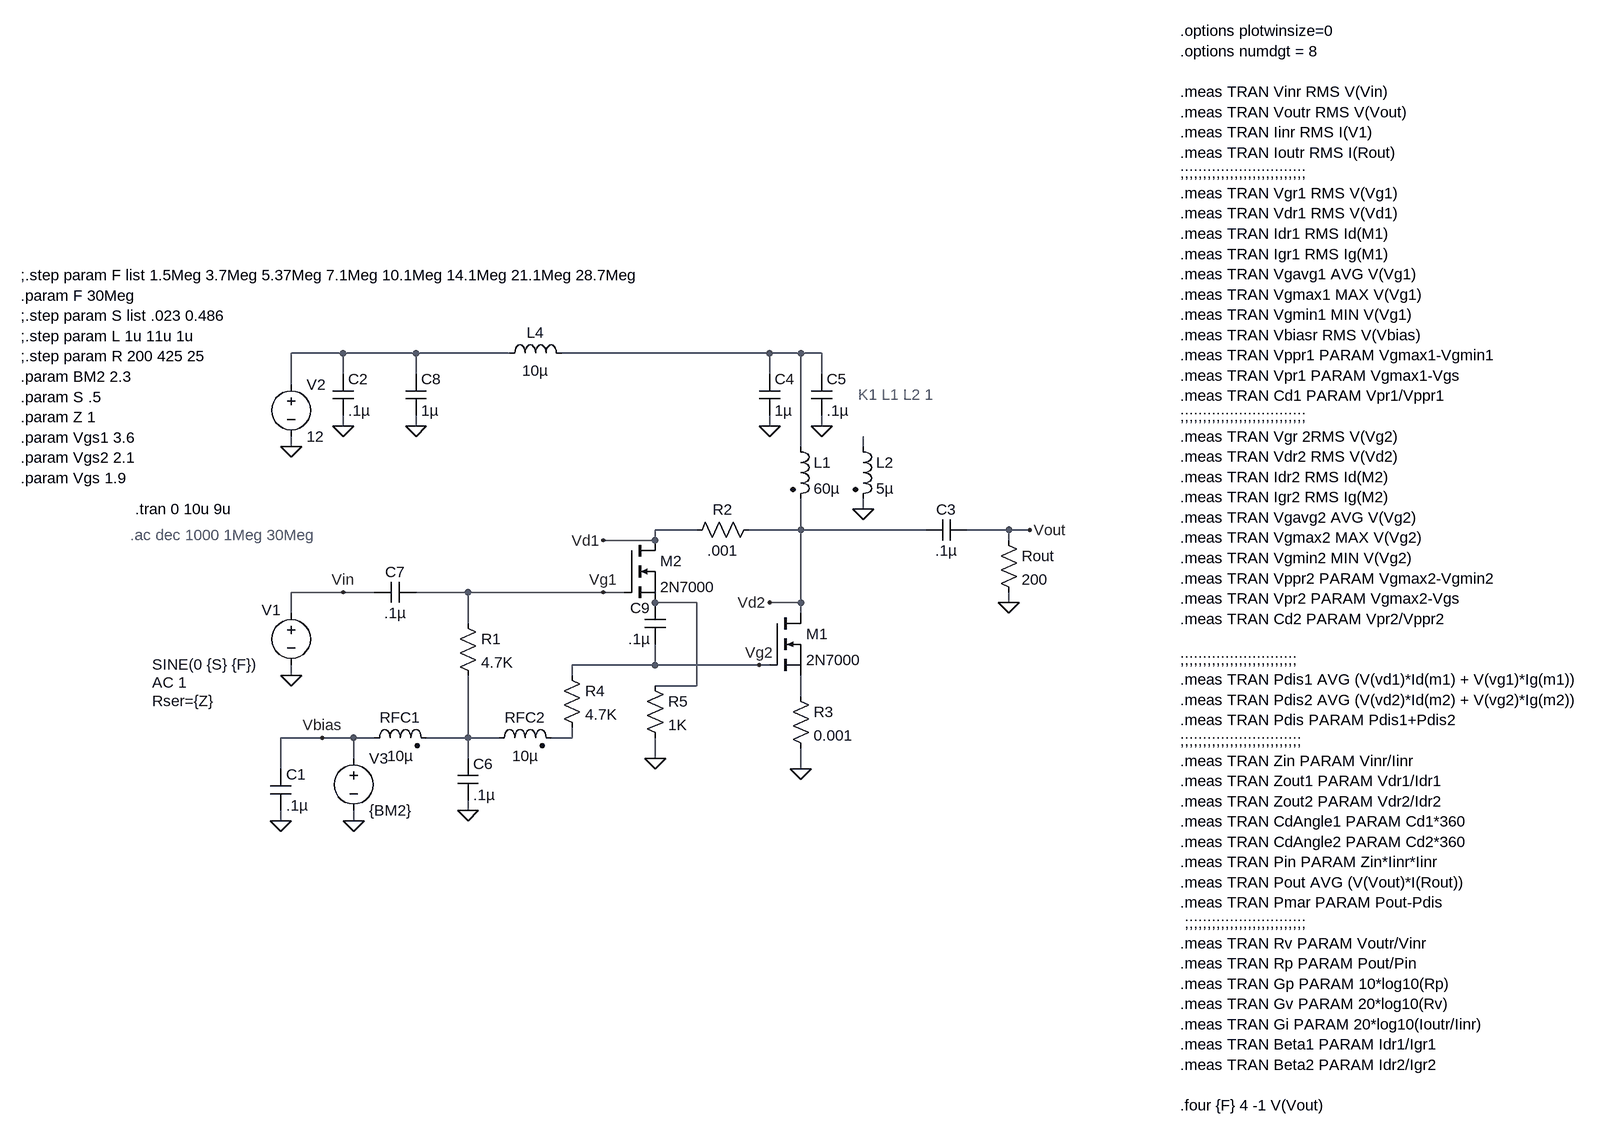
[diagram p0: schematic 2N7000 Darlington testing.asc]
2N7000 Darlington testing.asc, the LTspice schematic file:
Version 4
SHEET 1 3360 1496
WIRE -64 -176 -144 -176
WIRE 48 -176 -64 -176
WIRE 192 -176 48 -176
WIRE 592 -176 272 -176
WIRE 640 -176 592 -176
WIRE 672 -176 640 -176
WIRE -64 -144 -64 -176
WIRE 48 -144 48 -176
WIRE 592 -144 592 -176
WIRE 672 -144 672 -176
WIRE -144 -128 -144 -176
WIRE -64 -64 -64 -80
WIRE 48 -64 48 -80
WIRE 592 -64 592 -80
WIRE 672 -64 672 -80
WIRE -144 -32 -144 -48
WIRE 640 -32 640 -176
WIRE 736 -32 736 -48
WIRE 736 64 736 48
WIRE 480 96 416 96
WIRE 640 96 640 48
WIRE 640 96 560 96
WIRE 832 96 640 96
WIRE 960 96 896 96
WIRE 992 96 960 96
WIRE 416 112 416 96
WIRE 416 112 336 112
WIRE 960 112 960 96
WIRE -64 192 -144 192
WIRE -16 192 -64 192
WIRE 128 192 48 192
WIRE 336 192 128 192
WIRE 368 192 336 192
WIRE 480 208 416 208
WIRE 640 208 640 96
WIRE 640 208 592 208
WIRE 960 208 960 192
WIRE -144 224 -144 192
WIRE 640 224 640 208
WIRE 128 240 128 192
WIRE 416 304 416 272
WIRE 416 304 288 304
WIRE 576 304 416 304
WIRE 592 304 576 304
WIRE -144 320 -144 304
WIRE 288 320 288 304
WIRE 480 336 480 208
WIRE 480 336 416 336
WIRE 640 352 640 320
WIRE -96 416 -160 416
WIRE -48 416 -96 416
WIRE -16 416 -48 416
WIRE 128 416 128 320
WIRE 128 416 64 416
WIRE 176 416 128 416
WIRE 288 416 288 400
WIRE 288 416 256 416
WIRE -48 448 -48 416
WIRE 128 448 128 416
WIRE 416 448 416 416
WIRE -160 464 -160 416
WIRE 640 464 640 432
WIRE 128 528 128 512
WIRE -160 544 -160 528
WIRE -48 544 -48 528
FLAG -64 -64 0
FLAG -144 -32 0
FLAG -144 320 0
FLAG 992 96 Vout
FLAG 960 208 0
FLAG 592 -64 0
FLAG 672 -64 0
FLAG -64 192 Vin
FLAG 736 64 0
FLAG 48 -64 0
FLAG 640 464 0
FLAG 576 304 Vg2
FLAG 592 208 Vd2
FLAG 336 192 Vg1
FLAG 336 112 Vd1
FLAG -160 544 0
FLAG 128 528 0
FLAG -48 544 0
FLAG -96 416 Vbias
FLAG 416 448 0
SYMBOL voltage -144 208 R0
WINDOW 0 -45 11 Left 2
WINDOW 3 -214 95 Left 2
WINDOW 123 -214 123 Left 2
WINDOW 39 -214 151 Left 2
SYMATTR InstName V1
SYMATTR Value SINE(0 {S} {F})
SYMATTR Value2 AC 1
SYMATTR SpiceLine Rser={Z}
SYMBOL voltage -144 -144 R0
WINDOW 123 0 0 Left 0
WINDOW 39 0 0 Left 0
SYMATTR InstName V2
SYMATTR Value 12
SYMBOL cap -80 -144 R0
SYMATTR InstName C2
SYMATTR Value .1µ
SYMBOL cap 896 80 R90
WINDOW 0 0 32 VBottom 2
WINDOW 3 32 32 VTop 2
SYMATTR InstName C3
SYMATTR Value .1µ
SYMBOL ind2 624 -48 R0
SYMATTR InstName L1
SYMATTR Value 60µ
SYMATTR Type ind
SYMBOL res 944 96 R0
SYMATTR InstName Rout
SYMATTR Value 200
SYMBOL cap 576 -144 R0
SYMATTR InstName C4
SYMATTR Value 1µ
SYMBOL cap 656 -144 R0
SYMATTR InstName C5
SYMATTR Value .1µ
SYMBOL cap 48 176 R90
WINDOW 0 0 32 VBottom 2
WINDOW 3 32 32 VTop 2
SYMATTR InstName C7
SYMATTR Value .1µ
SYMBOL ind2 720 -48 R0
SYMATTR InstName L2
SYMATTR Value 5µ
SYMATTR Type ind
SYMBOL ind 176 -160 R270
WINDOW 0 32 56 VTop 2
WINDOW 3 5 56 VBottom 2
SYMATTR InstName L4
SYMATTR Value 10µ
SYMBOL cap 32 -144 R0
SYMATTR InstName C8
SYMATTR Value 1µ
SYMBOL res 624 336 R0
SYMATTR InstName R3
SYMATTR Value 0.001
SYMBOL nmos 592 224 R0
SYMATTR InstName M1
SYMATTR Value 2N7000
SYMBOL nmos 368 112 R0
SYMATTR InstName M2
SYMATTR Value 2N7000
SYMBOL res 112 224 R0
SYMATTR InstName R1
SYMATTR Value 4.7K
SYMBOL ind2 -32 432 R270
WINDOW 0 32 56 VTop 2
WINDOW 3 4 56 VBottom 2
SYMATTR InstName RFC1
SYMATTR Value 10µ
SYMATTR Type ind
SYMBOL cap -176 464 R0
SYMATTR InstName C1
SYMATTR Value .1µ
SYMBOL cap 112 448 R0
SYMATTR InstName C6
SYMATTR Value .1µ
SYMBOL voltage -48 432 R0
WINDOW 123 0 0 Left 2
WINDOW 39 0 0 Left 2
SYMATTR InstName V3
SYMATTR Value {BM2}
SYMBOL res 576 80 R90
WINDOW 0 0 56 VBottom 2
WINDOW 3 32 56 VTop 2
SYMATTR InstName R2
SYMATTR Value .001
SYMBOL res 400 320 R0
SYMATTR InstName R5
SYMATTR Value 1K
SYMBOL cap 432 272 R180
WINDOW 0 24 56 Left 2
WINDOW 3 24 8 Left 2
SYMATTR InstName C9
SYMATTR Value .1µ
SYMBOL res 272 304 R0
SYMATTR InstName R4
SYMATTR Value 4.7K
SYMBOL ind2 160 432 R270
WINDOW 0 32 56 VTop 2
WINDOW 3 4 56 VBottom 2
SYMATTR InstName RFC2
SYMATTR Value 10µ
SYMATTR Type ind
TEXT -384 64 Left 2 !.tran 0 10u 9u
TEXT -560 -296 Left 2 !;.step param F list 1.5Meg 3.7Meg 5.37Meg 7.1Meg 10.1Meg 14.1Meg 21.1Meg 28.7Meg\n.param F 30Meg\n;.step param S list .023 0.486\n;.step param L 1u 11u 1u\n;.step param R 200 425 25\n.param BM2 2.3\n.param S .5\n.param Z 1\n.param Vgs1 3.6\n.param Vgs2 2.1\n.param Vgs 1.9
TEXT 728 -112 Left 2 ;K1 L1 L2 1
TEXT -392 104 Left 2 ;.ac dec 1000 1Meg 30Meg
TEXT 1224 -672 Left 2 !.options plotwinsize=0\n.options numdgt = 8\n \n.meas TRAN Vinr RMS V(Vin)\n.meas TRAN Voutr RMS V(Vout)\n.meas TRAN Iinr RMS I(V1)\n.meas TRAN Ioutr RMS I(Rout)\n;;;;;;;;;;;;;;;;;;;;;;;;;;;;\n.meas TRAN Vgr1 RMS V(Vg1)\n.meas TRAN Vdr1 RMS V(Vd1)\n.meas TRAN Idr1 RMS Id(M1)\n.meas TRAN Igr1 RMS Ig(M1)\n.meas TRAN Vgavg1 AVG V(Vg1)\n.meas TRAN Vgmax1 MAX V(Vg1)\n.meas TRAN Vgmin1 MIN V(Vg1)\n.meas TRAN Vbiasr RMS V(Vbias)\n.meas TRAN Vppr1 PARAM Vgmax1-Vgmin1\n.meas TRAN Vpr1 PARAM Vgmax1-Vgs\n.meas TRAN Cd1 PARAM Vpr1/Vppr1\n;;;;;;;;;;;;;;;;;;;;;;;;;;;;\n.meas TRAN Vgr 2RMS V(Vg2)\n.meas TRAN Vdr2 RMS V(Vd2)\n.meas TRAN Idr2 RMS Id(M2)\n.meas TRAN Igr2 RMS Ig(M2)\n.meas TRAN Vgavg2 AVG V(Vg2)\n.meas TRAN Vgmax2 MAX V(Vg2)\n.meas TRAN Vgmin2 MIN V(Vg2)\n.meas TRAN Vppr2 PARAM Vgmax2-Vgmin2\n.meas TRAN Vpr2 PARAM Vgmax2-Vgs\n.meas TRAN Cd2 PARAM Vpr2/Vppr2\n \n;;;;;;;;;;;;;;;;;;;;;;;;;;\n.meas TRAN Pdis1 AVG (V(vd1)*Id(m1) + V(vg1)*Ig(m1))\n.meas TRAN Pdis2 AVG (V(vd2)*Id(m2) + V(vg2)*Ig(m2))\n.meas TRAN Pdis PARAM Pdis1+Pdis2\n;;;;;;;;;;;;;;;;;;;;;;;;;;;\n.meas TRAN Zin PARAM Vinr/Iinr\n.meas TRAN Zout1 PARAM Vdr1/Idr1\n.meas TRAN Zout2 PARAM Vdr2/Idr2\n.meas TRAN CdAngle1 PARAM Cd1*360\n.meas TRAN CdAngle2 PARAM Cd2*360\n.meas TRAN Pin PARAM Zin*Iinr*Iinr\n.meas TRAN Pout AVG (V(Vout)*I(Rout))\n.meas TRAN Pmar PARAM Pout-Pdis\n ;;;;;;;;;;;;;;;;;;;;;;;;;;;\n.meas TRAN Rv PARAM Voutr/Vinr\n.meas TRAN Rp PARAM Pout/Pin\n.meas TRAN Gp PARAM 10*log10(Rp)\n.meas TRAN Gv PARAM 20*log10(Rv)\n.meas TRAN Gi PARAM 20*log10(Ioutr/Iinr)\n.meas TRAN Beta1 PARAM Idr1/Igr1\n.meas TRAN Beta2 PARAM Idr2/Igr2\n \n.four {F} 4 -1 V(Vout)

The netlist it stands for:
* 2N7000 Darlington testing.asc
V1 Vin 0 SINE(0 {S} {F}) AC 1 Rser={Z}
V2 N001 0 12
C2 N001 0 .1µ
C3 Vout Vd2 .1µ
L1 N002 Vd2 60µ
Rout Vout 0 200
C4 N002 0 1µ
C5 N002 0 .1µ
C7 Vg1 Vin .1µ
L2 N003 0 5µ
L4 N001 N002 10µ
C8 N001 0 1µ
R3 N005 0 0.001
M1 Vd2 Vg2 N005 N005 2N7000
M2 Vd1 Vg1 N004 N004 2N7000
R1 Vg1 N006 4.7K
L§RFC1 Vbias N006 10µ
C1 Vbias 0 .1µ
C6 N006 0 .1µ
V3 Vbias 0 {BM2}
R2 Vd2 Vd1 .001
R5 N004 0 1K
C9 Vg2 N004 .1µ
R4 Vg2 N007 4.7K
L§RFC2 N006 N007 10µ
.model NMOS NMOS
.model PMOS PMOS
.lib standard.mos
.tran 0 10u 9u
;.step param F list 1.5Meg 3.7Meg 5.37Meg 7.1Meg 10.1Meg 14.1Meg 21.1Meg 28.7Meg
.param F 30Meg
;.step param S list .023 0.486
;.step param L 1u 11u 1u
;.step param R 200 425 25
.param BM2 2.3
.param S .5
.param Z 1
.param Vgs1 3.6
.param Vgs2 2.1
.param Vgs 1.9
* K1 L1 L2 1
* .ac dec 1000 1Meg 30Meg
.options plotwinsize=0
.options numdgt = 8
.meas TRAN Vinr RMS V(Vin)
.meas TRAN Voutr RMS V(Vout)
.meas TRAN Iinr RMS I(V1)
.meas TRAN Ioutr RMS I(Rout)
;;;;;;;;;;;;;;;;;;;;;;;;;;;;
.meas TRAN Vgr1 RMS V(Vg1)
.meas TRAN Vdr1 RMS V(Vd1)
.meas TRAN Idr1 RMS Id(M1)
.meas TRAN Igr1 RMS Ig(M1)
.meas TRAN Vgavg1 AVG V(Vg1)
.meas TRAN Vgmax1 MAX V(Vg1)
.meas TRAN Vgmin1 MIN V(Vg1)
.meas TRAN Vbiasr RMS V(Vbias)
.meas TRAN Vppr1 PARAM Vgmax1-Vgmin1
.meas TRAN Vpr1 PARAM Vgmax1-Vgs
.meas TRAN Cd1 PARAM Vpr1/Vppr1
;;;;;;;;;;;;;;;;;;;;;;;;;;;;
.meas TRAN Vgr 2RMS V(Vg2)
.meas TRAN Vdr2 RMS V(Vd2)
.meas TRAN Idr2 RMS Id(M2)
.meas TRAN Igr2 RMS Ig(M2)
.meas TRAN Vgavg2 AVG V(Vg2)
.meas TRAN Vgmax2 MAX V(Vg2)
.meas TRAN Vgmin2 MIN V(Vg2)
.meas TRAN Vppr2 PARAM Vgmax2-Vgmin2
.meas TRAN Vpr2 PARAM Vgmax2-Vgs
.meas TRAN Cd2 PARAM Vpr2/Vppr2
;;;;;;;;;;;;;;;;;;;;;;;;;;
.meas TRAN Pdis1 AVG (V(vd1)*Id(m1) + V(vg1)*Ig(m1))
.meas TRAN Pdis2 AVG (V(vd2)*Id(m2) + V(vg2)*Ig(m2))
.meas TRAN Pdis PARAM Pdis1+Pdis2
;;;;;;;;;;;;;;;;;;;;;;;;;;;
.meas TRAN Zin PARAM Vinr/Iinr
.meas TRAN Zout1 PARAM Vdr1/Idr1
.meas TRAN Zout2 PARAM Vdr2/Idr2
.meas TRAN CdAngle1 PARAM Cd1*360
.meas TRAN CdAngle2 PARAM Cd2*360
.meas TRAN Pin PARAM Zin*Iinr*Iinr
.meas TRAN Pout AVG (V(Vout)*I(Rout))
.meas TRAN Pmar PARAM Pout-Pdis
 ;;;;;;;;;;;;;;;;;;;;;;;;;;;
.meas TRAN Rv PARAM Voutr/Vinr
.meas TRAN Rp PARAM Pout/Pin
.meas TRAN Gp PARAM 10*log10(Rp)
.meas TRAN Gv PARAM 20*log10(Rv)
.meas TRAN Gi PARAM 20*log10(Ioutr/Iinr)
.meas TRAN Beta1 PARAM Idr1/Igr1
.meas TRAN Beta2 PARAM Idr2/Igr2
.four {F} 4 -1 V(Vout)
.backanno
.end